# EAGLE schematic SolderSync_v1_Schematics (EAGLE 9.7.0)
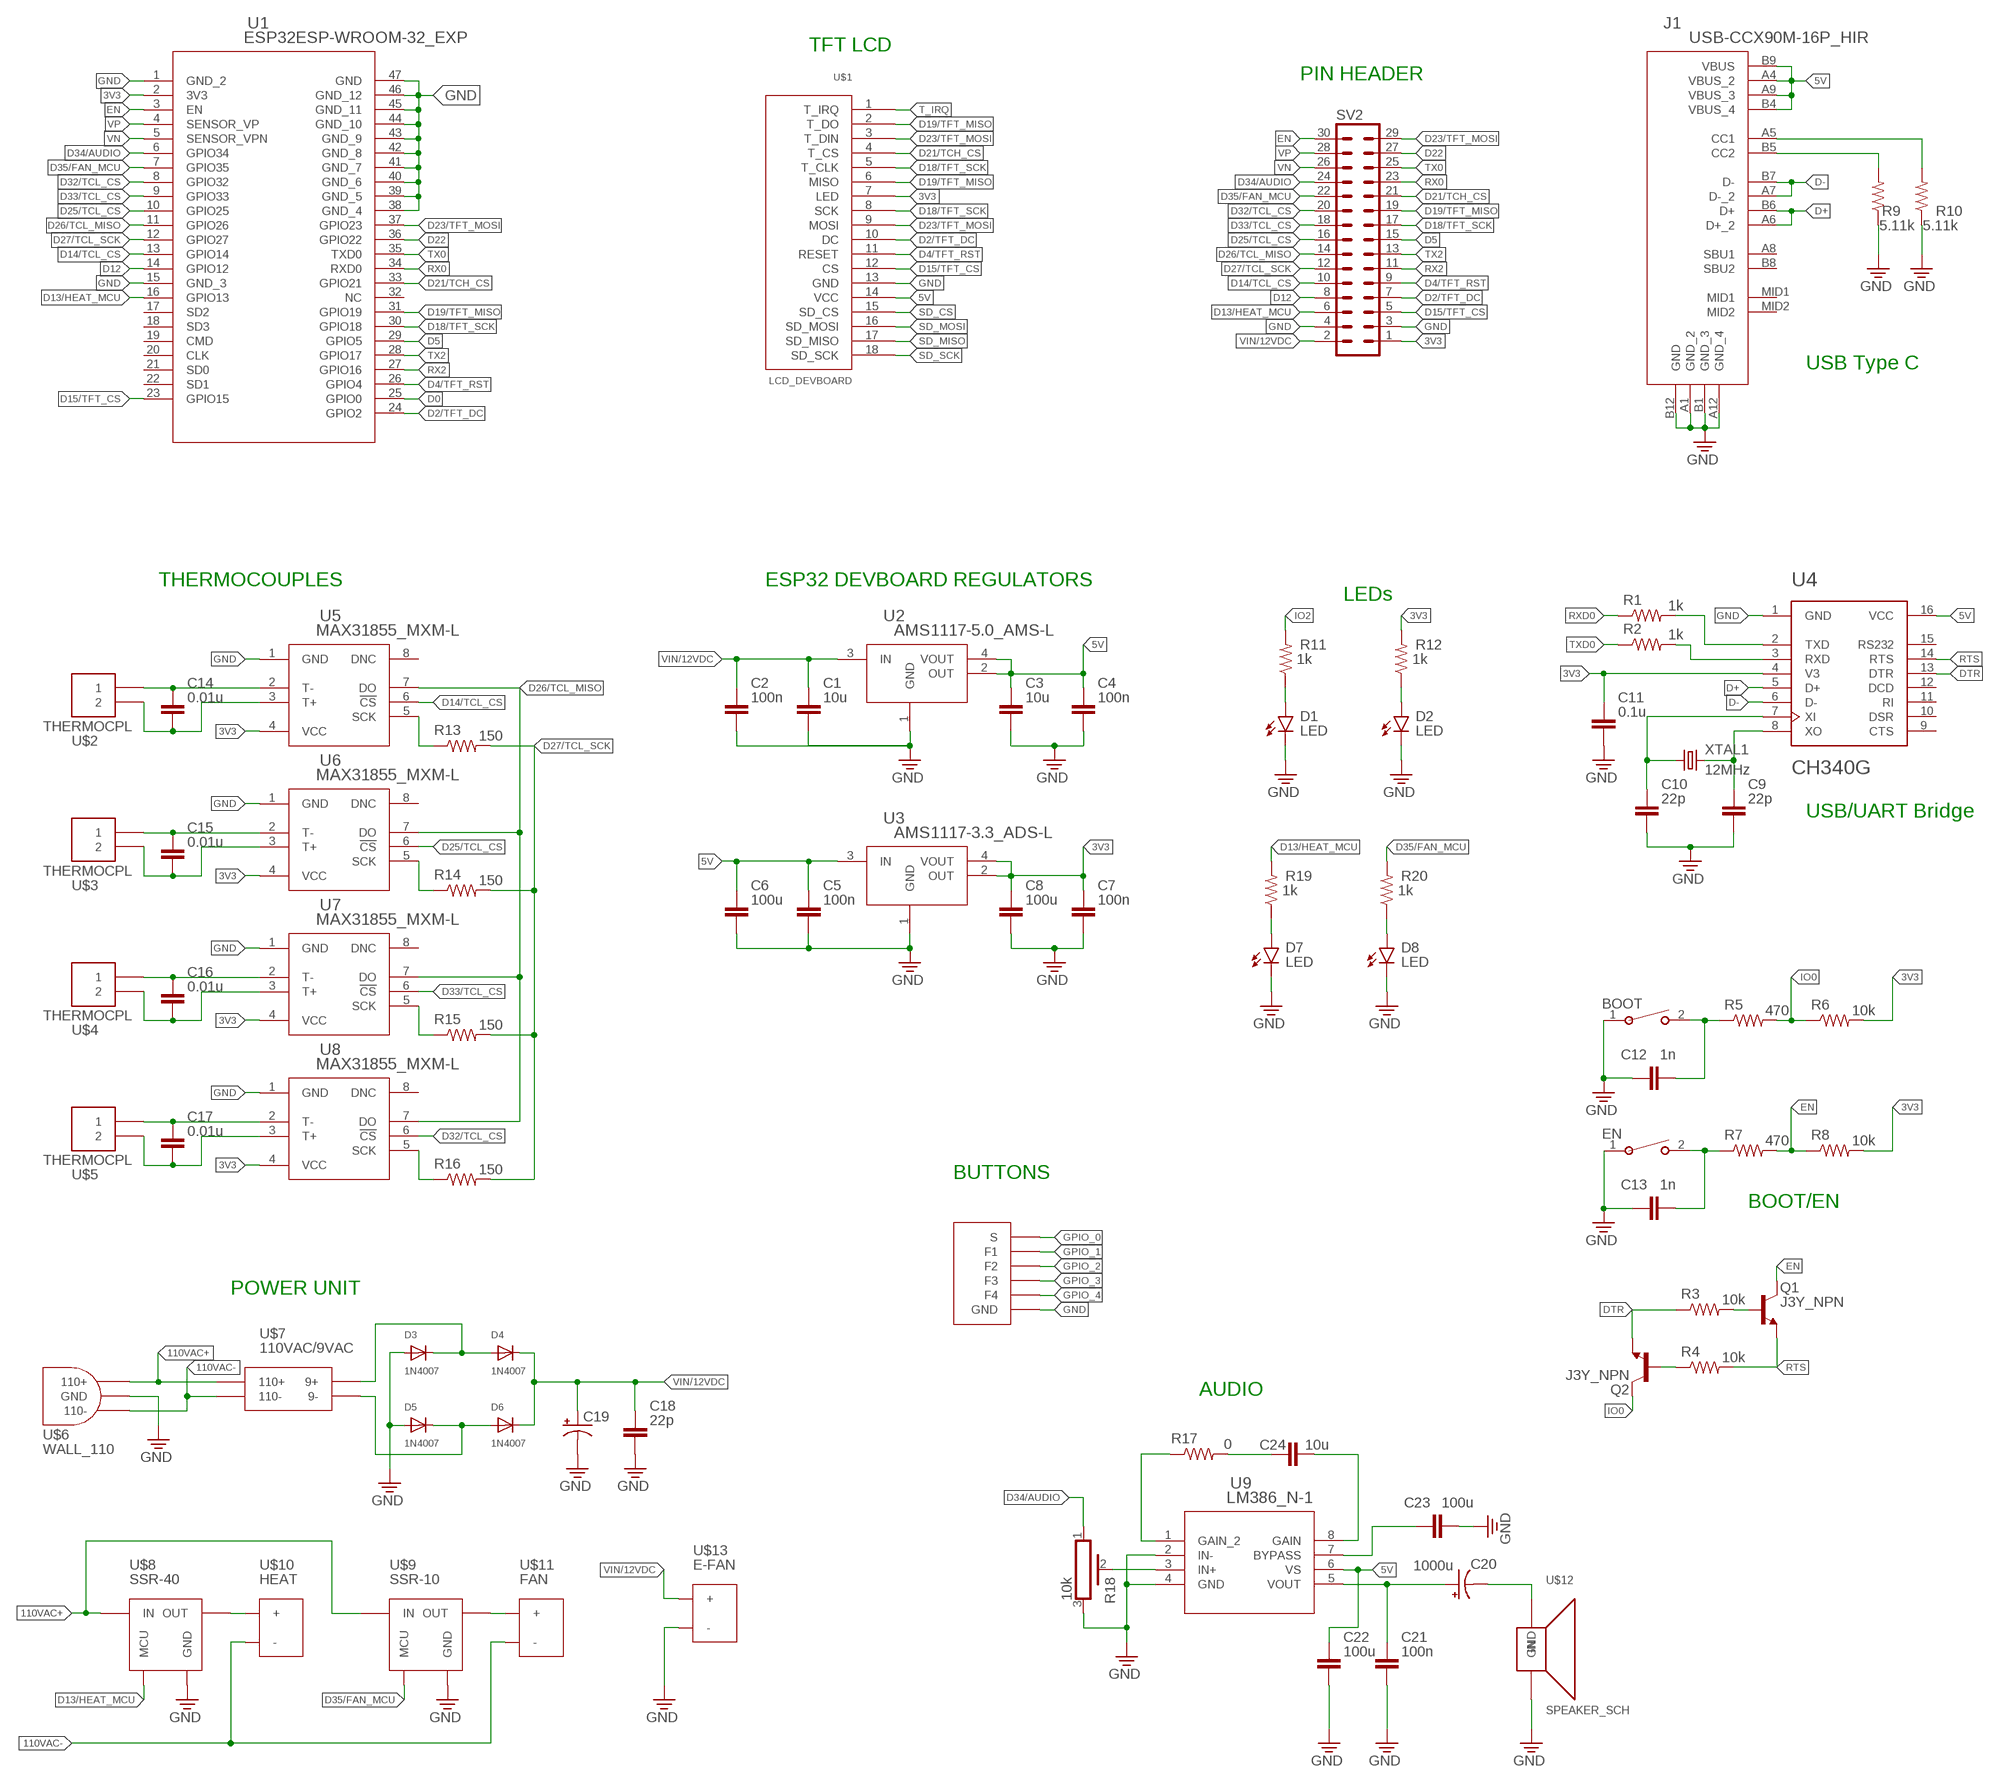
[diagram p0: schematic, sheet 1]

## Parts
BOOT  EVQ22705RSW_EVQ22705R_PAN  [SW_EVQ22705R_PAN]
C1  10u  C_CHIP-0805(2012-METRIC)  [CAPC2012X110]
C2  100n  C_CHIP-0805(2012-METRIC)  [CAPC2012X110]
C3  10u  C_CHIP-0805(2012-METRIC)  [CAPC2012X110]
C4  100n  C_CHIP-0805(2012-METRIC)  [CAPC2012X110]
C5  100n  C_CHIP-0805(2012-METRIC)  [CAPC2012X110]
C6  100u  C_CHIP-0805(2012-METRIC)  [CAPC2012X110]
C7  100n  C_CHIP-0805(2012-METRIC)  [CAPC2012X110]
C8  100u  C_CHIP-0805(2012-METRIC)  [CAPC2012X110]
C9  22p  C_CHIP-0805(2012-METRIC)  [CAPC2012X110]
C10  22p  C_CHIP-0805(2012-METRIC)  [CAPC2012X110]
C11  0.1u  C_CHIP-0805(2012-METRIC)  [CAPC2012X110]
C12  1n  C_CHIP-0805(2012-METRIC)  [CAPC2012X110]
C13  1n  C_CHIP-0805(2012-METRIC)  [CAPC2012X110]
C14  0.01u  C_CHIP-0805(2012-METRIC)  [CAPC2012X110]
C15  0.01u  C_CHIP-0805(2012-METRIC)  [CAPC2012X110]
C16  0.01u  C_CHIP-0805(2012-METRIC)  [CAPC2012X110]
C17  0.01u  C_CHIP-0805(2012-METRIC)  [CAPC2012X110]
C18  22p  C_CHIP-0805(2012-METRIC)  [CAPC2012X110]
C19  C-POL-US_ECAP-8.5MM  [CAPAE830X1050N]
C20  1000u  C-POL-US_ECAP-8.5MM  [CAPAE830X1050N]
C21  100n  C_CHIP-0805(2012-METRIC)  [CAPC2012X110]
C22  100u  C_CHIP-0805(2012-METRIC)  [CAPC2012X110]
C23  100u  C_CHIP-0805(2012-METRIC)  [CAPC2012X110]
C24  10u  C_CHIP-0805(2012-METRIC)  [CAPC2012X110]
D1  LED  CHIP-FLAT-B_0805  [LEDC2012X110N_FLAT-B]
D2  LED  CHIP-FLAT-B_0805  [LEDC2012X110N_FLAT-B]
D3  1N4007  DIODE_SOD-123FL  [SOD-123FL]
D4  1N4007  DIODE_SOD-123FL  [SOD-123FL]
D5  1N4007  DIODE_SOD-123FL  [SOD-123FL]
D6  1N4007  DIODE_SOD-123FL  [SOD-123FL]
D7  LED  CHIP-FLAT-B_0805  [LEDC2012X110N_FLAT-B]
D8  LED  CHIP-FLAT-B_0805  [LEDC2012X110N_FLAT-B]
EN  EVQ22705RSW_EVQ22705R_PAN  [SW_EVQ22705R_PAN]
J1  USB-CCX90M-16P_HIR  [USB-C]
Q1  J3Y_NPN  NPN_SC59-BEC  [SC59]
Q2  J3Y_NPN  NPN_SC59-BEC  [SC59]
R1  1k  R-US_CHIP-0805(2012-METRIC)  [RESC2012X65]
R2  1k  R-US_CHIP-0805(2012-METRIC)  [RESC2012X65]
R3  10k  R-US_CHIP-0805(2012-METRIC)  [RESC2012X65]
R4  10k  R-US_CHIP-0805(2012-METRIC)  [RESC2012X65]
R5  470  R-US_CHIP-0805(2012-METRIC)  [RESC2012X65]
R6  10k  R-US_CHIP-0805(2012-METRIC)  [RESC2012X65]
R7  470  R-US_CHIP-0805(2012-METRIC)  [RESC2012X65]
R8  10k  R-US_CHIP-0805(2012-METRIC)  [RESC2012X65]
R9  5.11k  R-US_CHIP-0805(2012-METRIC)  [RESC2012X65]
R10  5.11k  R-US_CHIP-0805(2012-METRIC)  [RESC2012X65]
R11  1k  R-US_CHIP-0805(2012-METRIC)  [RESC2012X65]
R12  1k  R-US_CHIP-0805(2012-METRIC)  [RESC2012X65]
R13  150  R-US_CHIP-0805(2012-METRIC)  [RESC2012X65]
R14  150  R-US_CHIP-0805(2012-METRIC)  [RESC2012X65]
R15  150  R-US_CHIP-0805(2012-METRIC)  [RESC2012X65]
R16  150  R-US_CHIP-0805(2012-METRIC)  [RESC2012X65]
R17  0  R-US_CHIP-0805(2012-METRIC)  [RESC2012X65]
R18  10k  POT_PV36W  [PV36W]
R19  1k  R-US_CHIP-0805(2012-METRIC)  [RESC2012X65]
R20  1k  R-US_CHIP-0805(2012-METRIC)  [RESC2012X65]
SV2  30-PIN  [30-PIN]
U1  ESP32ESP-WROOM-32_EXP  [ESP32_SCH_PCB]
U2  AMS1117-5.0_AMS-L  [_AMS-L]
U3  AMS1117-3.3_ADS-L  [_ADS-L]
U4  CH340G  [SOIC127P600X180-16N]
U5  MAX31855_MXM-L  [_MXM-L]
U6  MAX31855_MXM-L  [_MXM-L]
U7  MAX31855_MXM-L  [_MXM-L]
U8  MAX31855_MXM-L  [_MXM-L]
U9  LM386_N-1  [N08E_TEX]
U$1  LCD_DEVBOARD  [LCD_SCH]
U$2  THERMOCPL  (no package)
U$3  THERMOCPL  (no package)
U$4  THERMOCPL  (no package)
U$5  THERMOCPL  (no package)
U$6  WALL_110  (no package)
U$7  110VAC/9VAC  (no package)
U$8  SSR-40  SSR  (no package)
U$9  SSR-10  SSR  (no package)
U$10  HEAT  (no package)
U$11  FAN  (no package)
U$12  SPEAKER_SCH  (no package)
U$13  E-FAN  (no package)
U$14  BUTTONS  (no package)
XTAL1  12MHz  CRYSTAL_HC49-11.5L  [XTALRR488W45L1150T500H350B]

## Nets
3V3: C7.1 C8.1 C11.1 R6.2 R8.2 R12.2 SV2.1 U1.2(3V3) U3.2(OUT) U3.4(VOUT) U4.4(V3) U5.4(VCC) U6.4(VCC) U7.4(VCC) U8.4(VCC) U$1.7(LED)
5V: C3.1 C4.1 C5.1 C6.1 C22.1 J1.A4(VBUS_2) J1.A9(VBUS_3) J1.B4(VBUS_4) J1.B9(VBUS) U2.2(OUT) U2.4(VOUT) U3.3(IN) U4.16(VCC) U9.6(VS) U$1.14(VCC)
110VAC+: U$6.110+ U$7.110+ U$8.IN U$9.IN
110VAC-: U$6.110- U$7.110- U$10.- U$11.-
CC1: J1.A5(CC1) R10.2
CC2: J1.B5(CC2) R9.2
D0: U1.25(GPIO0)
D2/TFT_DC: SV2.7 U1.24(GPIO2) U$1.10(DC)
D4/TFT_RST: SV2.9 U1.26(GPIO4) U$1.11(RESET)
D5: SV2.15 U1.29(GPIO5)
D12: SV2.8 U1.14(GPIO12)
D13/HEAT_MCU: R19.2 SV2.6 U1.16(GPIO13) U$8.MCU
D14/TCL_CS: SV2.10 U1.13(GPIO14) U5.6(!CS)
D15/TFT_CS: SV2.5 U1.23(GPIO15) U$1.12(CS)
D18/TFT_SCK: SV2.17 U1.30(GPIO18) U$1.5(T_CLK) U$1.8(SCK)
D19/TFT_MISO: SV2.19 U1.31(GPIO19) U$1.2(T_DO) U$1.6(MISO)
D21/TCH_CS: SV2.21 U1.33(GPIO21) U$1.4(T_CS)
D22: SV2.27 U1.36(GPIO22)
D23/TFT_MOSI: SV2.29 U1.37(GPIO23) U$1.3(T_DIN) U$1.9(MOSI)
D25/TCL_CS: SV2.16 U1.10(GPIO25) U6.6(!CS)
D26/TCL_MISO: SV2.14 U1.11(GPIO26) U5.7(DO) U6.7(DO) U7.7(DO) U8.7(DO)
D27/TCL_SCK: R13.2 R14.2 R15.2 R16.2 SV2.12 U1.12(GPIO27)
D32/TCL_CS: SV2.20 U1.8(GPIO32) U8.6(!CS)
D33/TCL_CS: SV2.18 U1.9(GPIO33) U7.6(!CS)
D34/AUDIO: R18.1 SV2.24 U1.6(GPIO34)
D35/FAN_MCU: R20.2 SV2.22 U1.7(GPIO35) U$9.MCU
D+: J1.A6(D+_2) J1.B6(D+) U4.5(D+)
D-: J1.A7(D-_2) J1.B7(D-) U4.6(D-)
DTR: Q2.E R3.1 U4.13(DTR)
EN: Q1.C R7.2 R8.1 SV2.30 U1.3(EN)
GND: BOOT.1 C1.2 C2.2 C3.2 C4.2 C5.2 C6.2 C7.2 C8.2 C9.2 C10.2 C11.2 C12.1 C13.1 C18.2 C19.2(-) C21.2 C22.2 C23.2 D1.C D2.C D3.A D5.A D7.C D8.C EN.1 J1.A1(GND_2) J1.A12(GND_4) J1.B1(GND_3) J1.B12(GND) R9.1 R10.1 R18.3 SV2.3 SV2.4 U1.1(GND_2) U1.15(GND_3) U1.38(GND_4) U1.39(GND_5) U1.40(GND_6) U1.41(GND_7) U1.42(GND_8) U1.43(GND_9) U1.44(GND_10) U1.45(GND_11) U1.46(GND_12) U1.47(GND) U2.1(GND) U3.1(GND) U4.1(GND) U5.1(GND) U6.1(GND) U7.1(GND) U8.1(GND) U9.2(IN-) U9.4(GND) U$1.13(GND) U$6.GND U$8.GND U$9.GND U$12.GND U$13.- U$14.GND
GPIO_0: U$14.S
GPIO_1: U$14.F1
GPIO_2: U$14.F2
GPIO_3: U$14.F3
GPIO_4: U$14.F4
IO0: Q2.C R5.2 R6.1
IO2: R11.2
N$1: D1.A R11.1
N$2: Q1.B R3.2
N$3: BOOT.2 C12.2 R5.1
N$4: Q2.B R4.1
N$5: C14.2 U5.3(T+) U$2.2
N$6: D2.A R12.1
N$7: D3.C D4.A U$7.9+
N$8: C13.2 EN.2 R7.1
N$9: D5.C D6.A U$7.9-
N$10: C14.1 U5.2(T-) U$2.1
N$11: C15.2 U6.3(T+) U$3.2
N$12: C20.1(+) C21.1 U9.5(VOUT)
N$13: C20.2(-) U$12.IN
N$14: C15.1 U6.2(T-) U$3.1
N$15: C16.2 U7.3(T+) U$4.2
N$16: C23.1 U9.7(BYPASS)
N$17: U$8.OUT U$10.+
N$18: C16.1 U7.2(T-) U$4.1
N$19: C17.2 U8.3(T+) U$5.2
N$20: C24.1 R17.2
N$21: U$9.OUT U$11.+
N$22: C17.1 U8.2(T-) U$5.1
N$23: R17.1 U9.1(GAIN_2)
N$24: C24.2 U9.8(GAIN)
N$25: R18.2 U9.3(IN+)
N$26: D7.A R19.1
N$27: D8.A R20.1
RTS: Q1.E R4.2 U4.14(RTS)
RX0: SV2.23 U1.34(RXD0)
RX2: SV2.11 U1.27(GPIO16)
RXD: R2.2 U4.3(RXD)
RXD0: R1.1
SD_CS: U$1.15(SD_CS)
SD_MISO: U$1.17(SD_MISO)
SD_MOSI: U$1.16(SD_MOSI)
SD_SCK: U$1.18(SD_SCK)
T_IRQ: U$1.1(T_IRQ)
TCL_SCK1: R13.1 U5.5(SCK)
TCL_SCK2: R14.1 U6.5(SCK)
TCL_SCK3: R15.1 U7.5(SCK)
TCL_SCK4: R16.1 U8.5(SCK)
TX0: SV2.25 U1.35(TXD0)
TX2: SV2.13 U1.28(GPIO17)
TXD: R1.2 U4.2(TXD)
TXD0: R2.1
VIN/12VDC: C1.1 C2.1 C18.1 C19.1(+) D4.C D6.C SV2.2 U2.3(IN) U$13.+
VN: SV2.26 U1.5(SENSOR_VPN)
VP: SV2.28 U1.4(SENSOR_VP)
XO: C9.1 C10.1 U4.7(XI) U4.8(XO) XTAL1.1 XTAL1.2
Unconnected: J1.A8(SBU1) J1.B8(SBU2) J1.MID1 J1.MID2 U1.17(SD2) U1.18(SD3) U1.19(CMD) U1.20(CLK) U1.21(SD0) U1.22(SD1) U1.32(NC) U4.9(CTS) U4.10(DSR) U4.11(RI) U4.12(DCD) U4.15(RS232) U5.8(DNC) U6.8(DNC) U7.8(DNC) U8.8(DNC)

## Notes on the sheet
- TFT LCD
- PIN HEADER
- USB Type C
- THERMOCOUPLES | ESP32 DEVBOARD REGULATORS
- LEDs
- USB/UART Bridge
- BUTTONS
- BOOT/EN
- POWER UNIT
- AUDIO

## Library data of the parts
BOOT EN = SD-SolderSync-Library:EVQ22705R; COPYRIGHT: Copyright (C) 2024 Ultra Librarian. All rights reserved.; MANUFACTURER_PART_NUMBER: EVQ-22705R; MFR_NAME: Panasonic
C1-C18 C21-C24 = Capacitor:C: Capacitor - Generic; CATEGORY: Capacitor
C19 C20 = Capacitor:C-POL-US: Capacitor Polarised - ANSI; CATEGORY: Capacitor
D1 D2 D7 D8 = LED:CHIP-FLAT-B; CATEGORY: LED; COLOR: BLUE; DESCRIPTION: CHIP LED FLAT; SUB-CATEGORY: CHIP; TYPE: FLAT_TOP; VALUE: LED_BLUE
D3-D6 = adafruit:DIODE: Diode SMADIODE - SMA Surface Mount Package 20V 1A Schottky Diode Digikey: 641-1014-6-ND DO-1N4148 - Through Hole Small Current Diode SOD-123 20V 1 A (.5mV Vf) Schottky Diode - Digikey: MBRX120TPMSCT-ND SOD-323 10V 570mA (.38mV Vf, 3ns) Schottky Diode - Digikey: ZLLS410CT-ND SOD-523 30V 30mA Schottky Diode (RB751S-40TE61) - Digikey: RB751S-40TE61CT-ND SOT23-R/W - SOT23 Package (R = Solder Paste/Reflow Ovens, W = Hand-Soldering) BAT54Film 40V 300mA - Digikey: 497-7162-1-ND
J1 = SD-SolderSync-Library:USB-C; COPYRIGHT: Copyright (C) 2024 Ultra Librarian. All rights reserved.; MANUFACTURER_PART_NUMBER: CX90M-16P; MFR_NAME: Hirose
Q1 Q2 = Transistor:NPN: NPN - Generic; CATEGORY: Transistor; SUB-CATEGORY: BJT; TYPE: NPN; VALUE: NPN
R1-R17 R19 R20 = Resistor:R-US: Resistor Fixed - ANSI; CATEGORY: Resistor; SUB-CATEGORY: Fixed
R18 = Tinkercad:POT: Rectangular Trimmer Potentiometers - PV36 Series Datasheet <https://www.bourns.com/docs/Product-Datasheets/pv36.pdf>; CATEGORY: Resistor; DESCRIPTION: Lead Sealed Type Multiturn PV36 Series; MANUFACTURER: BOURNS; MPN: PV36W; OPERATING_TEMPERATURE: -55 to +125 °C; PART_STATUS: Active; ROHS_COMPLIANCE: RoHS Compliant; SERIES: PV36; SUB-CATEGORY: Trimpot; TYPE: Lead Sealed
SV2 = SD-SolderSync-Library:30-PIN: PIN HEADER; OC_FARNELL: unknown; OC_NEWARK: unknown
U1 = SD-SolderSync-Library:ESP32; COPYRIGHT: Copyright (C) 2024 Ultra Librarian. All rights reserved.; MANUFACTURER_PART_NUMBER: ESP-WROOM-32; MFR_NAME: Espressif Systems
U2 = SD-SolderSync-Library:AMS1117-5.0; COPYRIGHT: Copyright (C) 2024 Ultra Librarian. All rights reserved.; MANUFACTURER_PART_NUMBER: AMS1117-5.0; MFR_NAME: ams OSRAM
U3 = SD-SolderSync-Library:AMS1117-3.3; COPYRIGHT: Copyright (C) 2024 Ultra Librarian. All rights reserved.; MANUFACTURER_PART_NUMBER: AMS1117-3.3; MFR_NAME: Advanced Monolithic Systems
U4 = SD-SolderSync-Library:CH340G: Check availability <https://pricing.snapeda.com/parts/Ch340G/WCH/view-part?ref=eda>; AVAILABILITY: Not in stock; CHECK_PRICES: https://www.snapeda.com/parts/Ch340G/WCH/view-part/?ref=eda; DESCRIPTION: USB Interface Integrated Circuit; MF: WCH; MP: Ch340G; PACKAGE: None; PRICE: None; SNAPEDA_LINK: https://www.snapeda.com/parts/Ch340G/WCH/view-part/?ref=snap
U5-U8 = SD-SolderSync-Library:MAX31855; COPYRIGHT: Copyright (C) 2024 Ultra Librarian. All rights reserved.; MANUFACTURER_PART_NUMBER: MAX31855KASA+; MFR_NAME: Analog Devices Inc
U9 = SD-SolderSync-Library:LM386; COPYRIGHT: Copyright (C) 2024 Ultra Librarian. All rights reserved.; MANUFACTURER_PART_NUMBER: LM386N-1/NOPB; MFR_NAME: Texas Instruments
U$1 = SD-SolderSync-Library:LCD_DEVBOARD
U$2-U$5 = SD-SolderSync-Library:THERMOCPL; _EXTERNAL_: _EXTERNAL_
U$6 = SD-SolderSync-Library:WALL_110; _EXTERNAL_: _EXTERNAL_
U$7 = SD-SolderSync-Library:110VAC/9VAC; _EXTERNAL_: _EXTERNAL_
U$8 U$9 = SD-SolderSync-Library:SSR; _EXTERNAL_: _EXTERNAL_
U$10 = SD-SolderSync-Library:HEAT; _EXTERNAL_: _EXTERNAL_
U$11 = SD-SolderSync-Library:FAN; _EXTERNAL_: _EXTERNAL_
U$12 = SD-SolderSync-Library:SPEAKER_SCH
U$13 = SD-SolderSync-Library:E-FAN; _EXTERNAL_: _EXTERNAL_
U$14 = SD-SolderSync-Library:BUTTONS; _EXTERNAL_: _EXTERNAL_
XTAL1 = Frequency-Source:CRYSTAL: Crystal 2Pin - Generic; CATEGORY: Frequency-Source; SERIES: HC49; SUB-CATEGORY: Crystal-2Pin